# EAGLE schematic V2 (EAGLE 7.2.0)
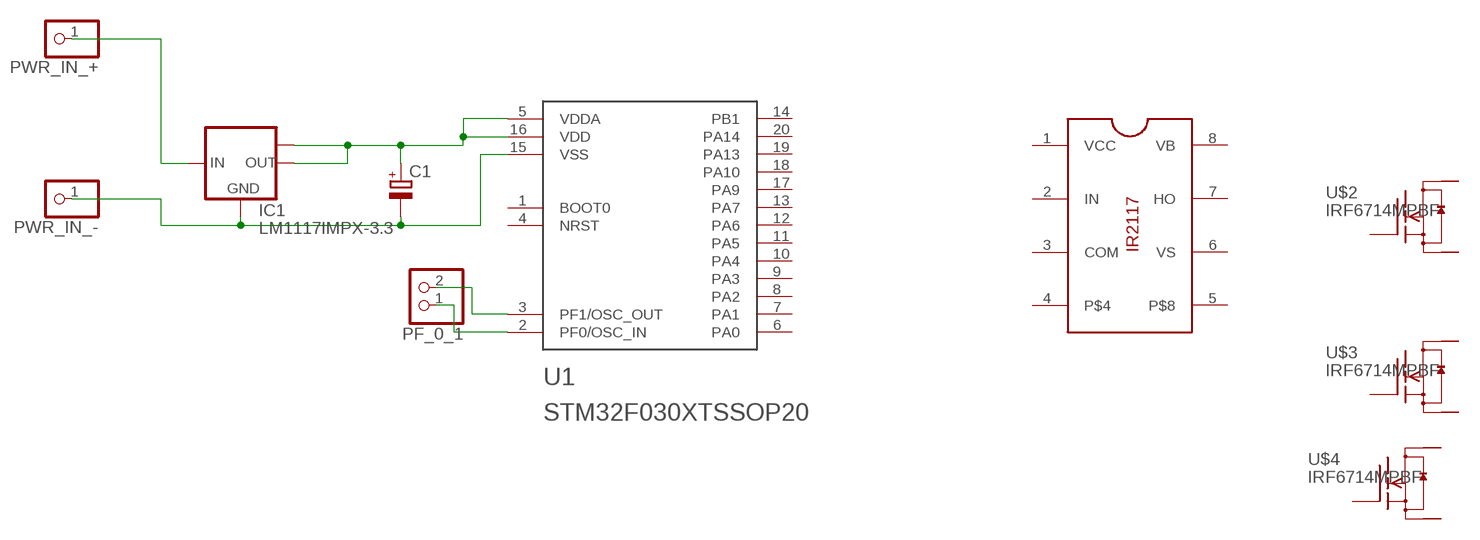
[diagram p0: schematic, sheet 1]

## Parts
C1  CPOL-EUSMCD  [SMC_D]
IC1  LM1117IMPX-3.3  [SOT223]
PF_0_1  PINHD-1X2  [1X02]
PWR_IN_+  PINHD-1X1  [1X01]
PWR_IN_-  PINHD-1X1  [1X01]
U1  STM32F030XTSSOP20  [TSSOP-20]
U$1  IR2117SPBF  [SO8]
U$2  IRF6714MPBF  [DIRECTFET-MX]
U$3  IRF6714MPBF  [DIRECTFET-MX]
U$4  IRF6714MPBF  [DIRECTFET-MX]

## Nets
N$2: PF_0_1.2 U1.3(PF1/OSC_OUT)
N$5: IC1.3(IN) PWR_IN_+.1
N$24: PF_0_1.1 U1.2(PF0/OSC_IN)
N$27: C1.- IC1.1(GND) PWR_IN_-.1 U1.15(VSS)
N$29: C1.+ IC1.2(OUT) IC1.TAB(OUT1) U1.5(VDDA) U1.16(VDD)
Unconnected: U1.1(BOOT0) U1.4(NRST) U1.6(PA0) U1.7(PA1) U1.8(PA2) U1.9(PA3) U1.10(PA4) U1.11(PA5) U1.12(PA6) U1.13(PA7) U1.14(PB1) U1.17(PA9) U1.18(PA10) U1.19(PA13) U1.20(PA14) U$1.1(VCC) U$1.2(IN) U$1.3(COM) U$1.4 U$1.5 U$1.6(VS) U$1.7(HO) U$1.8(VB) U$2.D(V)(D) U$2.G U$2.S U$3.D(V)(D) U$3.G U$3.S U$4.D(V)(D) U$4.G U$4.S

## Library data of the parts
C1 = resistor:CPOL-EU: POLARIZED CAPACITOR, European symbol
IC1 = lm1117:LM1117IMPX-*
PF_0_1 = pinhead:PINHD-1X2: PIN HEADER
PWR_IN_+ PWR_IN_- = pinhead:PINHD-1X1: PIN HEADER
U1 = stm32f030x:STM32F030X
U$1 = mosfet_drivers:IR2117SPBF
U$2-U$4 = power_mosfets:IRF6714MPBF: IRF6714MPBF N-channel directfet MOSFET Структура n-канал Максимальное напряжение сток-исток Uси,В 25 Максимальный ток сток-исток при 25 С Iси макс..А 29 Максимальное напряжение затвор-исток Uзи макс.,В ±20 Сопротивление канала в открытом состоянии Rси вкл.,мОм 3.4 Максимальная рассеиваемая мощность Pси макс..Вт 89 Крутизна характеристики, S 122 Корпус directfet mx Пороговое напряжение на затворе 1.4…2.4